# EAGLE schematic GameIT_HSRW (EAGLE 9.6.2)
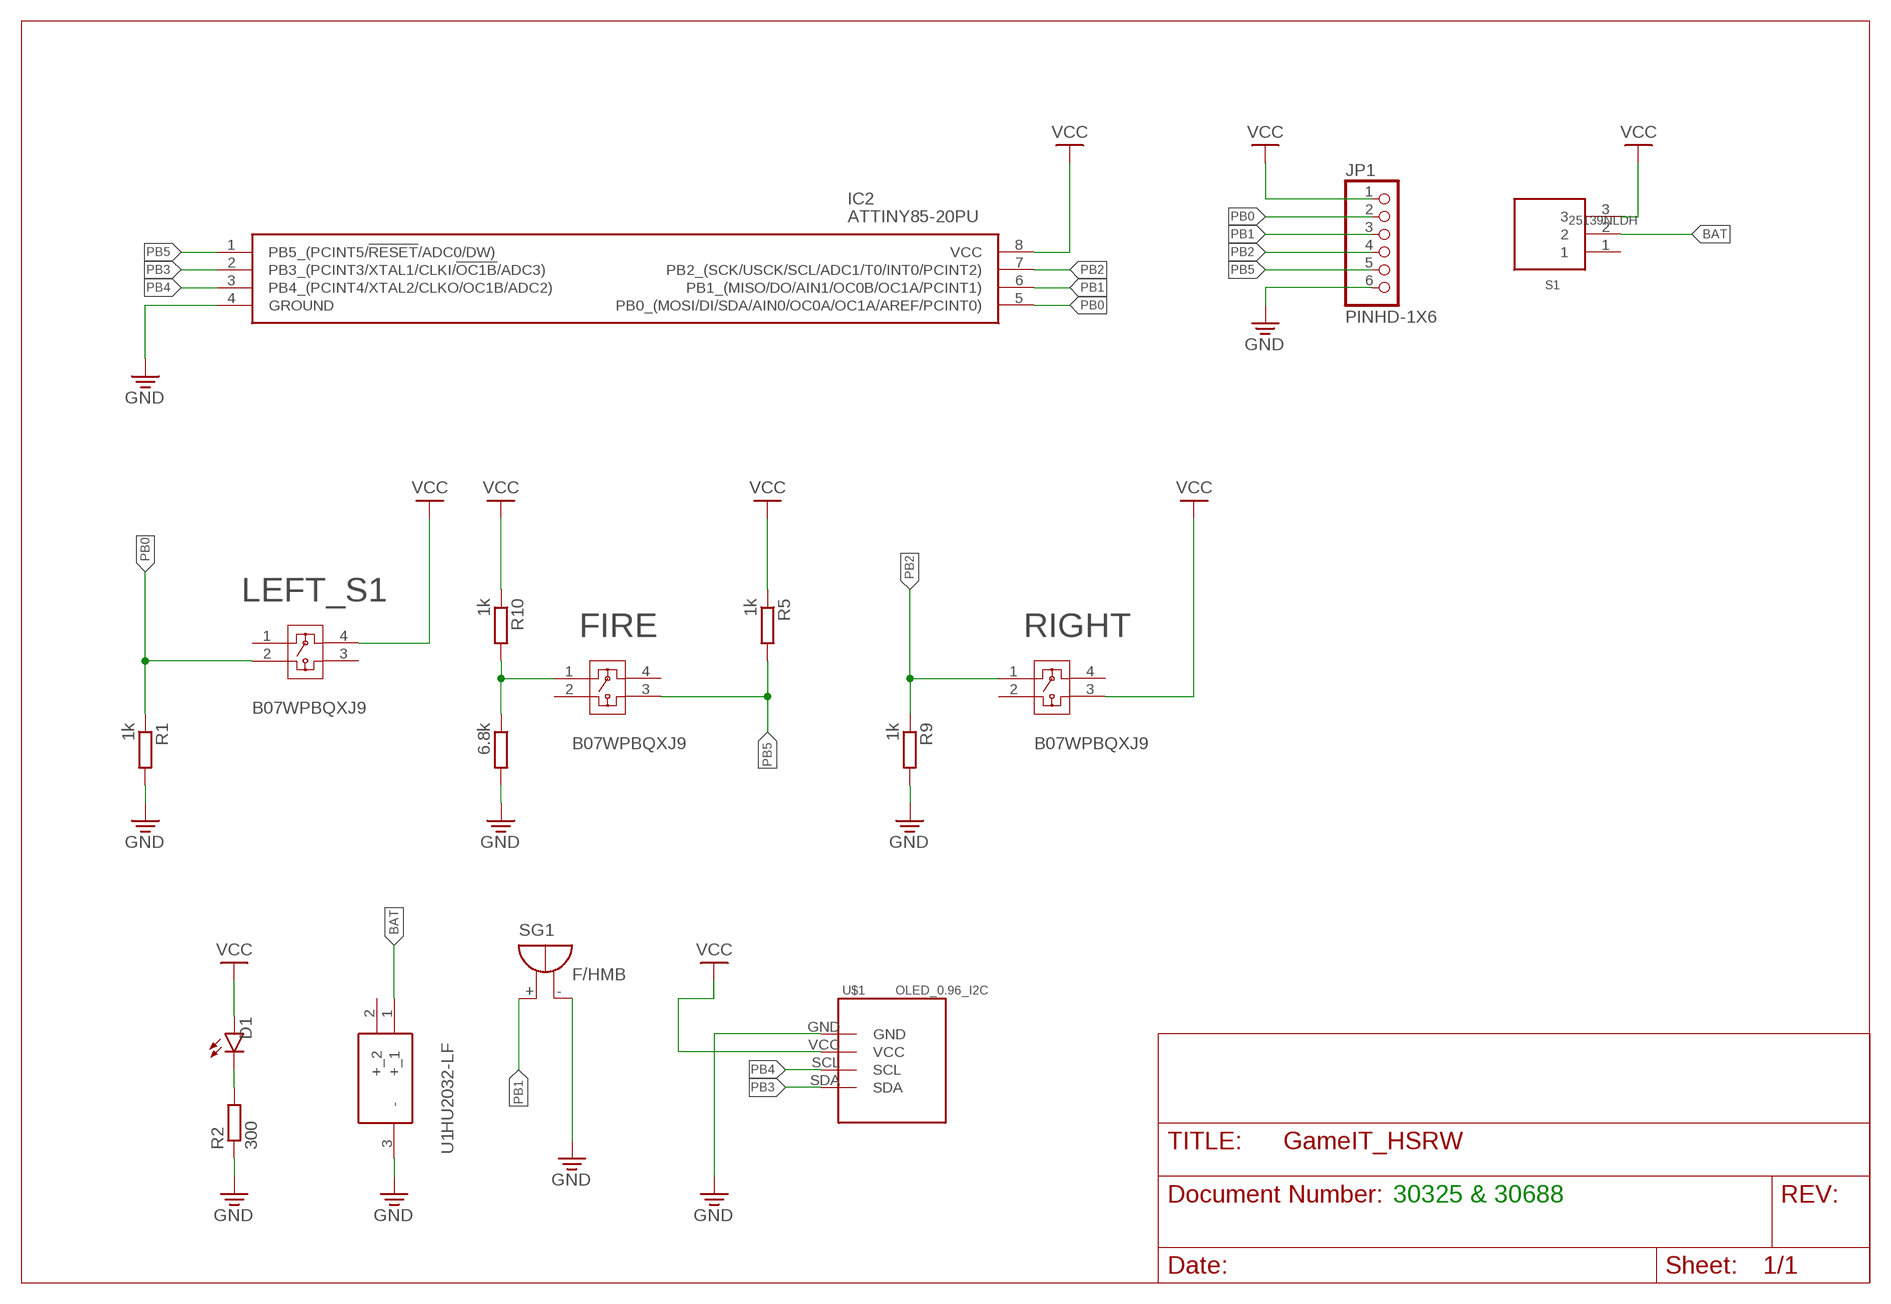
[diagram p0: schematic, sheet 1]

## Parts
D1  LED_GREEN  LEDCHIPLED_1206  [CHIPLED_1206]
FIRE  COM-10302COM-10302_SPK  [COM-10302_SPK]
IC2  ATTINY85-20PU  [DIP781W56P254L950H533Q8N]
JP1  PINHD-1X6  [1X06]
LEFT_S1  COM-10302COM-10302_SPK  [COM-10302_SPK]
R1  1k  R-EU_R1206  [R1206]
R2  300  R-EU_R1206  [R1206]
R4  6.8k  R-EU_R1206  [R1206]
R5  1k  R-EU_R1206  [R1206]
R9  1k  R-EU_R1206  [R1206]
R10  1k  R-EU_R1206  [R1206]
RIGHT  COM-10302COM-10302_SPK  [COM-10302_SPK]
S1  25139NLDH  [25139NLDH]
SG1  F/HMB  [F/HMB]
U1  HU2032-LF  [HU2032LF]
U$1  OLED_0.96_I2C  [OLED_0.96_I2C]

## Nets
BAT: S1.2 U1.1(+_1)
GND: IC2.4(GROUND) JP1.6 R1.2 R2.1 R4.2 R9.2 SG1.- U1.3(-) U$1.GND
N$1: FIRE.1 R4.1 R10.2
N$3: D1.C R2.2
PB0: IC2.5(PB0_(MOSI/DI/SDA/AIN0/OC0A/OC1A/AREF/PCINT0)) JP1.2 LEFT_S1.2 R1.1
PB1: IC2.6(PB1_(MISO/DO/AIN1/OC0B/OC1A/PCINT1)) JP1.3 SG1.+
PB2: IC2.7(PB2_(SCK/USCK/SCL/ADC1/T0/INT0/PCINT2)) JP1.4 R9.1 RIGHT.1
PB3: IC2.2(PB3_(PCINT3/XTAL1/CLKI/!OC1B!/ADC3)) U$1.SDA
PB4: IC2.3(PB4_(PCINT4/XTAL2/CLKO/OC1B/ADC2)) U$1.SCL
PB5: FIRE.3 IC2.1(PB5_(PCINT5/!RESET!/ADC0/DW)) JP1.5 R5.2
VCC: D1.A IC2.8(VCC) JP1.1 LEFT_S1.4 R5.1 R10.1 RIGHT.3 S1.3 U$1.VCC
Unconnected: FIRE.2 FIRE.4 LEFT_S1.1 LEFT_S1.3 RIGHT.2 RIGHT.4 S1.1 U1.2(+_2)

## Notes on the sheet
- B07WPBQXJ9
- B07WPBQXJ9 | B07WPBQXJ9
- 30325 & 30688

## Library data of the parts
D1 = led:LED: LED OSRAM: - CHIPLED LG R971, LG N971, LY N971, LG Q971, LY Q971, LO R971, LY R971 LH N974, LH R974 LS Q976, LO Q976, LY Q976 LO Q996 - Hyper CHIPLED LW Q18S LB Q993, LB Q99A, LB R99A - SideLED LS A670, LO A670, LY A670, LG A670, LP A670 LB A673, LV A673, LT A673, LW A673 LH A674 LY A675 LS A676, LA A676, LO A676, LY A676, LW A676 LS A679, LY A679, LG A679 - Hyper Micro SIDELED® LS Y876, LA Y876, LO Y876, LY Y876 LT Y87S - SmartLED LW L88C, LW L88S LB L89C, LB L89S, LG L890 LS L89K, LO L89K, LY L89K LS L896, LA L896, LO L896, LY L896 - TOPLED LS T670, LO T670, LY T670, LG T670, LP T670 LSG T670, LSP T670, LSY T670, LOP T670, LYG T670 LG T671, LOG T671, LSG T671 LB T673, LV T673, LT T673, LW T673 LH T674 LS T676, LA T676, LO T676, LY T676, LB T676, LH T676, LSB T676, LW T676 LB T67C, LV T67C, LT T67C, LS T67K, LO T67K, LY T67K, LW E67C LS E67B, LA E67B, LO E67B, LY E67B, LB E67C, LV E67C, LT E67C LW T67C LS T679, LY T679, LG T679 LS T770, LO T770, LY T770, LG T770, LP T770 LB T773, LV T773, LT T773, LW T773 LH T774 LS E675, LA E675, LY E675, LS T675 LS T776, LA T776, LO T776, LY T776, LB T776 LHGB T686 LT T68C, LB T68C - Hyper Mini TOPLED® LB M676 - Mini TOPLED Santana® LG M470 LS M47K, LO M47K, LY M47K Source: http://www.osram.convergy.de LUXEON: - LUMILED® LXK2-PW12-R00, LXK2-PW12-S00, LXK2-PW14-U00, LXK2-PW14-V00 LXK2-PM12-R00, LXK2-PM12-S00, LXK2-PM14-U00 LXK2-PE12-Q00, LXK2-PE12-R00, LXK2-PE12-S00, LXK2-PE14-T00, LXK2-PE14-U00 LXK2-PB12-K00, LXK2-PB12-L00, LXK2-PB12-M00, LXK2-PB14-N00, LXK2-PB14-P00, LXK2-PB14-Q00 LXK2-PR12-L00, LXK2-PR12-M00, LXK2-PR14-Q00, LXK2-PR14-R00 LXK2-PD12-Q00, LXK2-PD12-R00, LXK2-PD12-S00 LXK2-PH12-R00, LXK2-PH12-S00 LXK2-PL12-P00, LXK2-PL12-Q00, LXK2-PL12-R00 Source: www.luxeon.com KINGBRIGHT: KA-3528ASYC Source: www.kingbright.com
FIRE LEFT_S1 RIGHT = 2023-10-24_09-55-51_Library:COM-10302; COPYRIGHT: Copyright (C) 2023 Ultra Librarian. All rights reserved.; MANUFACTURER_PART_NUMBER: COM-10302; MFR_NAME: Sparkfun
IC2 = ATTINY85-20PU:ATTINY85-20PU: MICROCHIP - ATTINY85-20PU - MICROCONTROLLER MCU, 8 BIT, ATTINY, 20MHZ, DIP-8 Source: Datasheet <https://componentsearchengine.com/Datasheets/2/ATTINY85-20PU.pdf>; DESCRIPTION: MICROCHIP - ATTINY85-20PU - MICROCONTROLLER MCU, 8 BIT, ATTINY, 20MHZ, DIP-8; HEIGHT: 5.334mm; MANUFACTURER_NAME: Microchip; MANUFACTURER_PART_NUMBER: ATTINY85-20PU; MOUSER_PART_NUMBER: 556-ATTINY85-20PU; MOUSER_PRICE-STOCK: https://www.mouser.co.uk/ProductDetail/Microchip-Technology/ATTINY85-20PU?qs=8jWQYweyg6NCiiaOb5GI9Q%3D%3D
JP1 = Connector:PINHD-1X6: PIN HEADER; CATEGORY: Headers; DESCRIPTION: Header, Straight, 6 Position; MANUFACTURER: Generic; MPN: Generic; OPERATING_TEMPERATURE: Generic; PART_STATUS: Active; PITCH: 0.100" (2.54mm); ROHS_COMPLIANCE: Generic; SERIES: Generic; SUB-CATEGORY: Headers, Male Pins; TYPE: Board to Board or Cable, Unshrouded, Through Hole, Straight
R1 R2 R4 R5 R9 R10 = rcl:R-EU_: RESISTOR, European symbol; SPICEPREFIX: R
S1 = 25139NLDH:25139NLDH: Slide Switches SPDT 0.4VA 20VAC/DC On-Off-On Source: Datasheet <https://www.mouser.com/datasheet/2/26/PCB-slideswitches-serie-25000N-1511380.pdf>; DESCRIPTION: Slide Switches SPDT 0.4VA 20VAC/DC On-Off-On; HEIGHT: 8.1mm; MANUFACTURER_NAME: Apem; MANUFACTURER_PART_NUMBER: 25139NLDH; MOUSER_PART_NUMBER: 642-25139NLDH; MOUSER_PRICE-STOCK: https://www.mouser.com/Search/Refine.aspx?Keyword=642-25139NLDH
SG1 = buzzer:F/HMB: BUZZER Source: Buerklin; OC_FARNELL: unknown; OC_NEWARK: unknown
U1 = HU2032-LF:HU2032-LF: RENATA - HU2032-LF - HOLDER, BATTERY, THT, CR2032 Source: Datasheet <https://componentsearchengine.com/Datasheets/2/HU2032-LF.pdf>; DESCRIPTION: RENATA - HU2032-LF - HOLDER, BATTERY, THT, CR2032; HEIGHT: mm; MANUFACTURER_NAME: RENATA; MANUFACTURER_PART_NUMBER: HU2032-LF; MOUSER_PART_NUMBER: 614-HU2032-LF; MOUSER_PRICE-STOCK: https://www.mouser.co.uk/ProductDetail/Renata/HU2032-LF?qs=oUsD4qhOtFwA99zRPu3JIQ%3D%3D
U$1 = tft_1_8_1_44_oled_0_96:OLED_0.96_I2C